# Altium schematic sheet dac.SchDoc
size A4
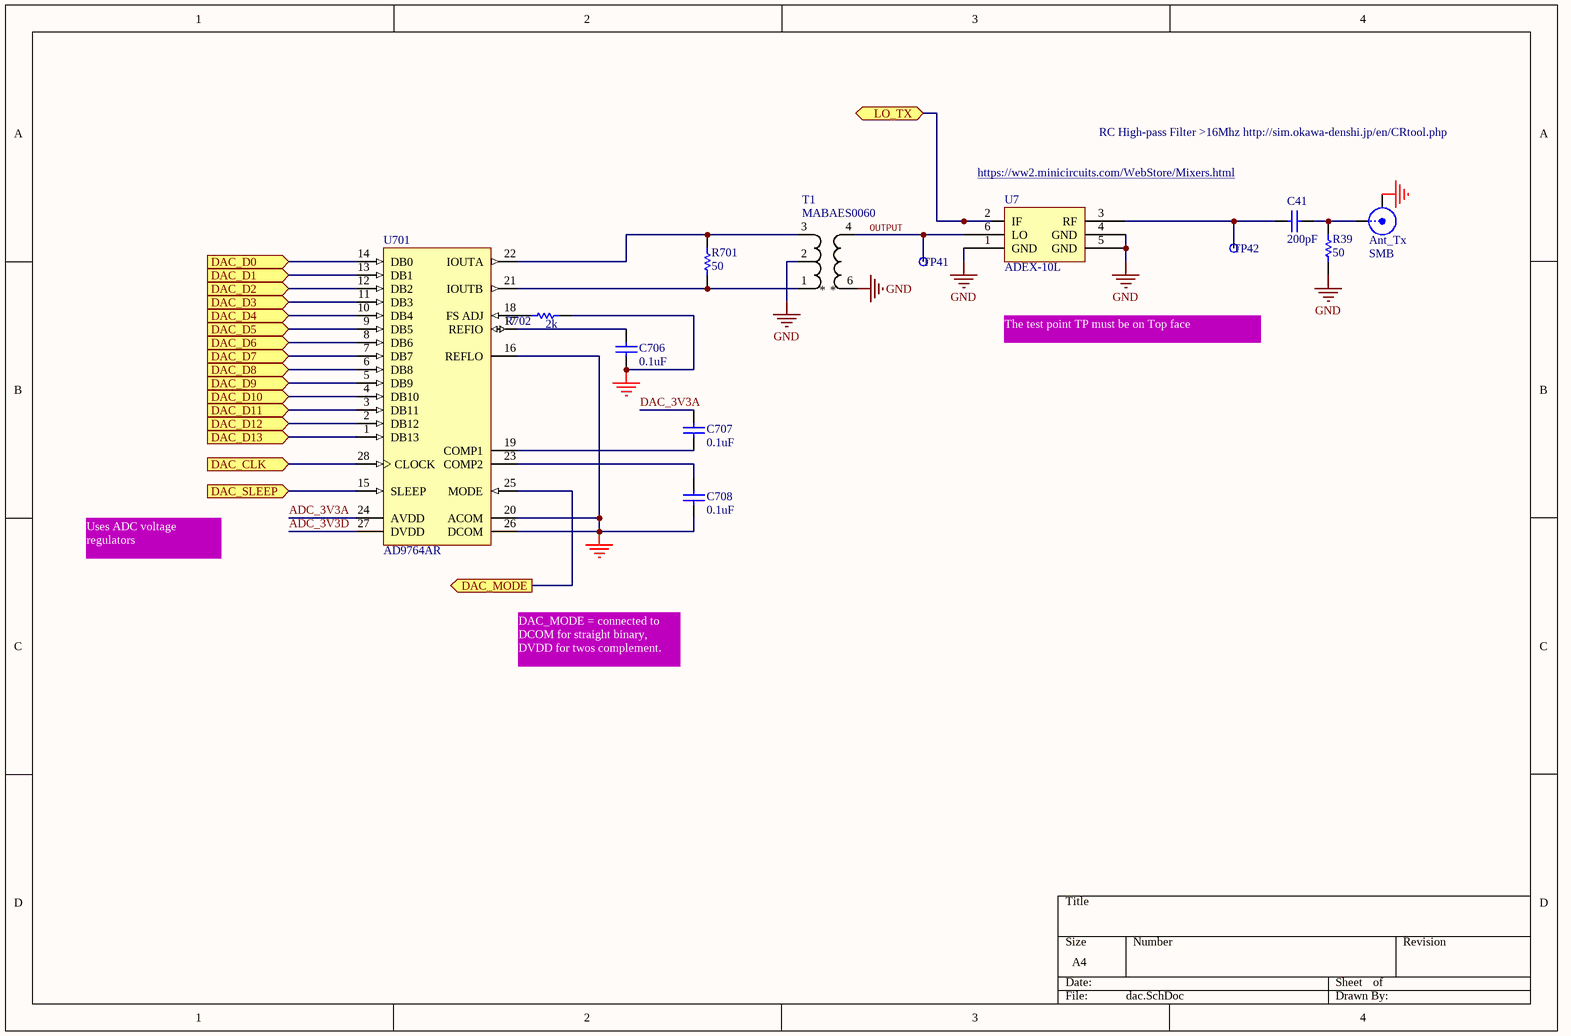
[diagram p0: dac.SchDoc]

## Parts
Ant_Tx  SMB  [SMB_V-RJ45]
C41  value 200pF  [0402]  (hidden comment: Cap Semi)
C706  0.1uF  [CAPC1005X55N]
C707  0.1uF  [CAPC1005X55N]
C708  0.1uF  [CAPC1005X55N]
R39  value 50  [0402]  (hidden comment: Res Semi)
R701  50  [RESC1005N]
R702  2k  [RESC1005N]
T1  MABAES0060  [MABAES0060]
TP41  LO_RX  [TPS127]  (value not drawn)
TP42  LO_RX  [TPS127]  (value not drawn)
U7  ADEX-10L
U701  AD9764AR  [TSSOP-28]

## Ports
DAC_CLK (in), DAC_D0 (in), DAC_D1 (in), DAC_D2 (in), DAC_D3 (in), DAC_D4 (in), DAC_D5 (in), DAC_D6 (in), DAC_D7 (in), DAC_D8 (in), DAC_D9 (in), DAC_D10 (in), DAC_D11 (in), DAC_D12 (in), DAC_D13 (in), DAC_MODE (out), DAC_SLEEP (in), LO_TX

## Nets
GND: Ant_Tx.2(Y) C706.1 C708.1 R39.1 R702.2 T1.2 T1.6 U7.1(GND) U7.4(GND) U7.5(GND) U701.16(REFLO) U701.20(ACOM) U701.26(DCOM)
ADC_3V3A: U701.24(AVDD)
ADC_3V3D: U701.27(DVDD)
DAC_3V3A: C707.1
DAC_CLK: U701.28(CLOCK) ; port DAC_CLK
DAC_D0: U701.14(DB0) ; port DAC_D0
DAC_D1: U701.13(DB1) ; port DAC_D1
DAC_D2: U701.12(DB2) ; port DAC_D2
DAC_D3: U701.11(DB3) ; port DAC_D3
DAC_D4: U701.10(DB4) ; port DAC_D4
DAC_D5: U701.9(DB5) ; port DAC_D5
DAC_D6: U701.8(DB6) ; port DAC_D6
DAC_D7: U701.7(DB7) ; port DAC_D7
DAC_D8: U701.6(DB8) ; port DAC_D8
DAC_D9: U701.5(DB9) ; port DAC_D9
DAC_D10: U701.4(DB10) ; port DAC_D10
DAC_D11: U701.3(DB11) ; port DAC_D11
DAC_D12: U701.2(DB12) ; port DAC_D12
DAC_D13: U701.1(DB13) ; port DAC_D13
DAC_MODE: U701.25(MODE) ; port DAC_MODE
DAC_SLEEP: U701.15(SLEEP) ; port DAC_SLEEP
LO_TX: U7.2(IF) ; port LO_TX
OUTPUT: T1.4 TP41.1 U7.6(LO)
NetAnt_Tx_1: Ant_Tx.1(X) C41.2 R39.2
NetC41_1: C41.1 TP42.1 U7.3(RF)
NetC706_2: C706.2 U701.17(REFIO)
NetC707_2: C707.2 U701.19(COMP1)
NetC708_2: C708.2 U701.23(COMP2)
NetR701_1: R701.1 T1.3 U701.22(IOUTA)
NetR701_2: R701.2 T1.1 U701.21(IOUTB)
NetR702_1: R702.1 U701.18(FS_ADJ)

## Notes on the sheet
- https://ww2.minicircuits.com/WebStore/Mixers.html
- RC High-pass Filter >16Mhz http://sim.okawa-denshi.jp/en/CRtool.php
- The test point TP must be on Top face
- Uses ADC voltage regulators
- DAC_MODE = connected to DCOM for straight binary, DVDD for twos complement.

## Library data of the parts
Ant_Tx = SMB: SMB Straight Connector; LatestRevisionDate: 17-Jul-2002; LatestRevisionNote: Re-released for DXP Platform.; Publisher: Altium Limited
C41 = Cap Semi: Capacitor (Semiconductor SIM Model); Published: 8-Jun-2000; LatestRevisionDate: 29-May-2009; LatestRevisionNote: IPC-7351 Footprint Added.; PackageReference: C1206; Publisher: Altium Limited; PackageDescription: Chip Capacitor
C706-C708 = Cap: Capacitor; Manufacturer: Panasonic; Manufacturer Part Number: ECJ-2VF1C104Z; Published: 8-Jun-2000; Revision: July-2002: Re-released for DXP Platform.; Publisher: Altium Limited; Value: 0.1uF; Distributor: Digikey; Distributor Part Number: PCC1843CT-ND
R39 = Res Semi: Semiconductor Resistor; Published: 8-Jun-2000; LatestRevisionDate: 17-Jul-2002; LatestRevisionNote: Re-released for DXP Platform.; PackageReference: AXIAL-0.5; Publisher: Altium Limited; PackageDescription: Axial Device, Thru-Hole; 2 Leads; 0.5 in Pin Spacing
R701 = Res1: Resistor; Manufacturer: Generic Components; Class I: Passive; Value: 1K; Published: 8-Jun-2000; Revision: July-2002: Re-released for DXP Platform.; Publisher: Altium Limited; Class II: Resistor
R702 = Res1: Resistor; Manufacturer: Generic Components; Class I: Passive; Published: 8-Jun-2000; Revision: July-2002: Re-released for DXP Platform.; Publisher: Altium Limited; Class II: Resistor; Value: 2K
T1 = Balun: Manufacturer: Mini-Circuits; Part Description: RF balun 0.3-200Mhz; Manufacturer Part Number 1: MABAES0060; Supplier Part Number 1: 1465-1317-1-ND; Supplier 1: digikey
TP41 TP42 = SMD_PAD_1.27X1.27MM: Test Point; Part Description: 1.27mm x 1.27mm PCB Copper Area (SMD Test Point); Mounted: No; Part Number: SMD_PAD_1.27X1.27MM; Component Kind: Standard (No BOM); Component Type: Standard (No BOM); Pin Count: 1; Family: Test Point; Socket: No; SMD: Yes; Sense: No; Status: None; ComponentHeight: 0mm; HelpURL: Undefined; Author: CERN DEM JLC; CreateDate: 12.01.2008; LatestRevisionDate: 12.01.2008; PackageDescription: 1.27mm x 1.27mm PCB Copper Area (SMD Test Point)
U7 = ADEX-10L: Passive Mixer
U701 = AD9764AR: Single 14-Bit TxDAC, 125 Msps, -40 to +85 degC, RW-28, Tube; ADI Part Number: AD9764; Manufacturer: Analog Devices; # DAC Outputs: 1; Max V+: 5.5V; Op Pwr Diss: 170mW; Resolution (Bits): 14; Settling Time: 35ns; Single Supply: Yes; DatasheetVersion: Rev.B; PackageVersion: 060706-A; PackageReference: RW-28; PackageDescription: 28-Lead Standard Small Outline Package [SOIC_W]; Packing: Tube; RoHS: N; Mounting Technology: Surface Mount; Code_JEDEC: MS-013-AE; ComponentLink1Description: Manufacturer URL; ComponentLink1URL: http://www.analog.com/en/index.html; ComponentLink2Description: Datasheet; ComponentLink2URL: http://www.analog.com/static/imported-files/data_sheets/AD9764.pdf; ComponentLink3Description: URL Link1; ComponentLink3URL: Product URL:http://www.analog.com/en/digital-to-analog-converters/da-converters/ad9764/products/product.html